# Altium schematic sheet SD_RAM.SchDoc
size A4; SheetNumber: 2; SheetTotal: 6
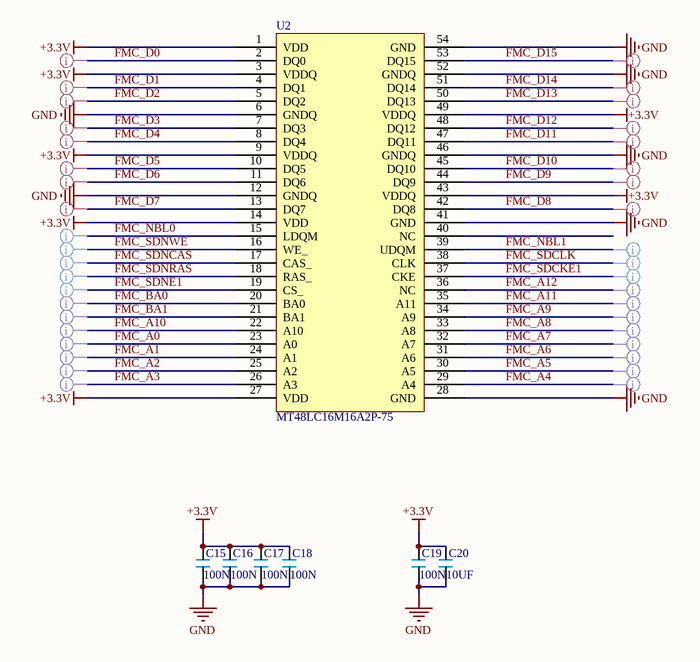
[diagram p0: SD_RAM.SchDoc]

## Parts
C15  100N  [0603]
C16  100N  [0603]
C17  100N  [0603]
C18  100N  [0603]
C19  100N  [0603]
C20  10UF  [0603]
U2  MT48LC16M16A2P-75  [TSOP-54]

## Nets
+3.3V: C15.2 C16.2 C17.2 C18.2 C19.2 C20.2 U2.1(VDD) U2.3(VDDQ) U2.9(VDDQ) U2.14(VDD) U2.27(VDD) U2.43(VDDQ) U2.49(VDDQ)
GND: C15.1 C16.1 C17.1 C18.1 C19.1 C20.1 U2.6(GNDQ) U2.12(GNDQ) U2.28(GND) U2.41(GND) U2.46(GNDQ) U2.52(GNDQ) U2.54(GND)
FMC_A0: U2.23(A0)
FMC_A1: U2.24(A1)
FMC_A2: U2.25(A2)
FMC_A3: U2.26(A3)
FMC_A4: U2.29(A4)
FMC_A5: U2.30(A5)
FMC_A6: U2.31(A6)
FMC_A7: U2.32(A7)
FMC_A8: U2.33(A8)
FMC_A9: U2.34(A9)
FMC_A10: U2.22(A10)
FMC_A11: U2.35(A11)
FMC_A12: U2.36(NC)
FMC_BA0: U2.20(BA0)
FMC_BA1: U2.21(BA1)
FMC_D0: U2.2(DQ0)
FMC_D1: U2.4(DQ1)
FMC_D2: U2.5(DQ2)
FMC_D3: U2.7(DQ3)
FMC_D4: U2.8(DQ4)
FMC_D5: U2.10(DQ5)
FMC_D6: U2.11(DQ6)
FMC_D7: U2.13(DQ7)
FMC_D8: U2.42(DQ8)
FMC_D9: U2.44(DQ9)
FMC_D10: U2.45(DQ10)
FMC_D11: U2.47(DQ11)
FMC_D12: U2.48(DQ12)
FMC_D13: U2.50(DQ13)
FMC_D14: U2.51(DQ14)
FMC_D15: U2.53(DQ15)
FMC_NBL0: U2.15(LDQM)
FMC_NBL1: U2.39(UDQM)
FMC_SDCKE1: U2.37(CKE)
FMC_SDCLK: U2.38(CLK)
FMC_SDNCAS: U2.17(CAS_)
FMC_SDNE1: U2.19(CS_)
FMC_SDNRAS: U2.18(RAS_)
FMC_SDNWE: U2.16(WE_)

Not connected (* = marked no-connect by the designer): U2 40(NC)

## Layout directives
net class FMC_DATA: FMC_D0, FMC_D1, FMC_D2, FMC_D3, FMC_D4, FMC_D5, FMC_D6, FMC_D7, FMC_D8, FMC_D9, FMC_D10, FMC_D11, FMC_D12, FMC_D13, FMC_D14, FMC_D15
net class FMC_ADDRESS: FMC_A0, FMC_A1, FMC_A2, FMC_A3, FMC_A4, FMC_A5, FMC_A6, FMC_A7, FMC_A8, FMC_A9, FMC_A10, FMC_A11, FMC_A12, FMC_BA0, FMC_BA1
net class FMC_COMMAND: FMC_NBL0, FMC_NBL1, FMC_SDCKE1, FMC_SDCLK, FMC_SDNCAS, FMC_SDNE1, FMC_SDNRAS, FMC_SDNWE

## Library data of the parts
C15-C20 = CAP